# EAGLE design Shield (EAGLE 7.2.0)
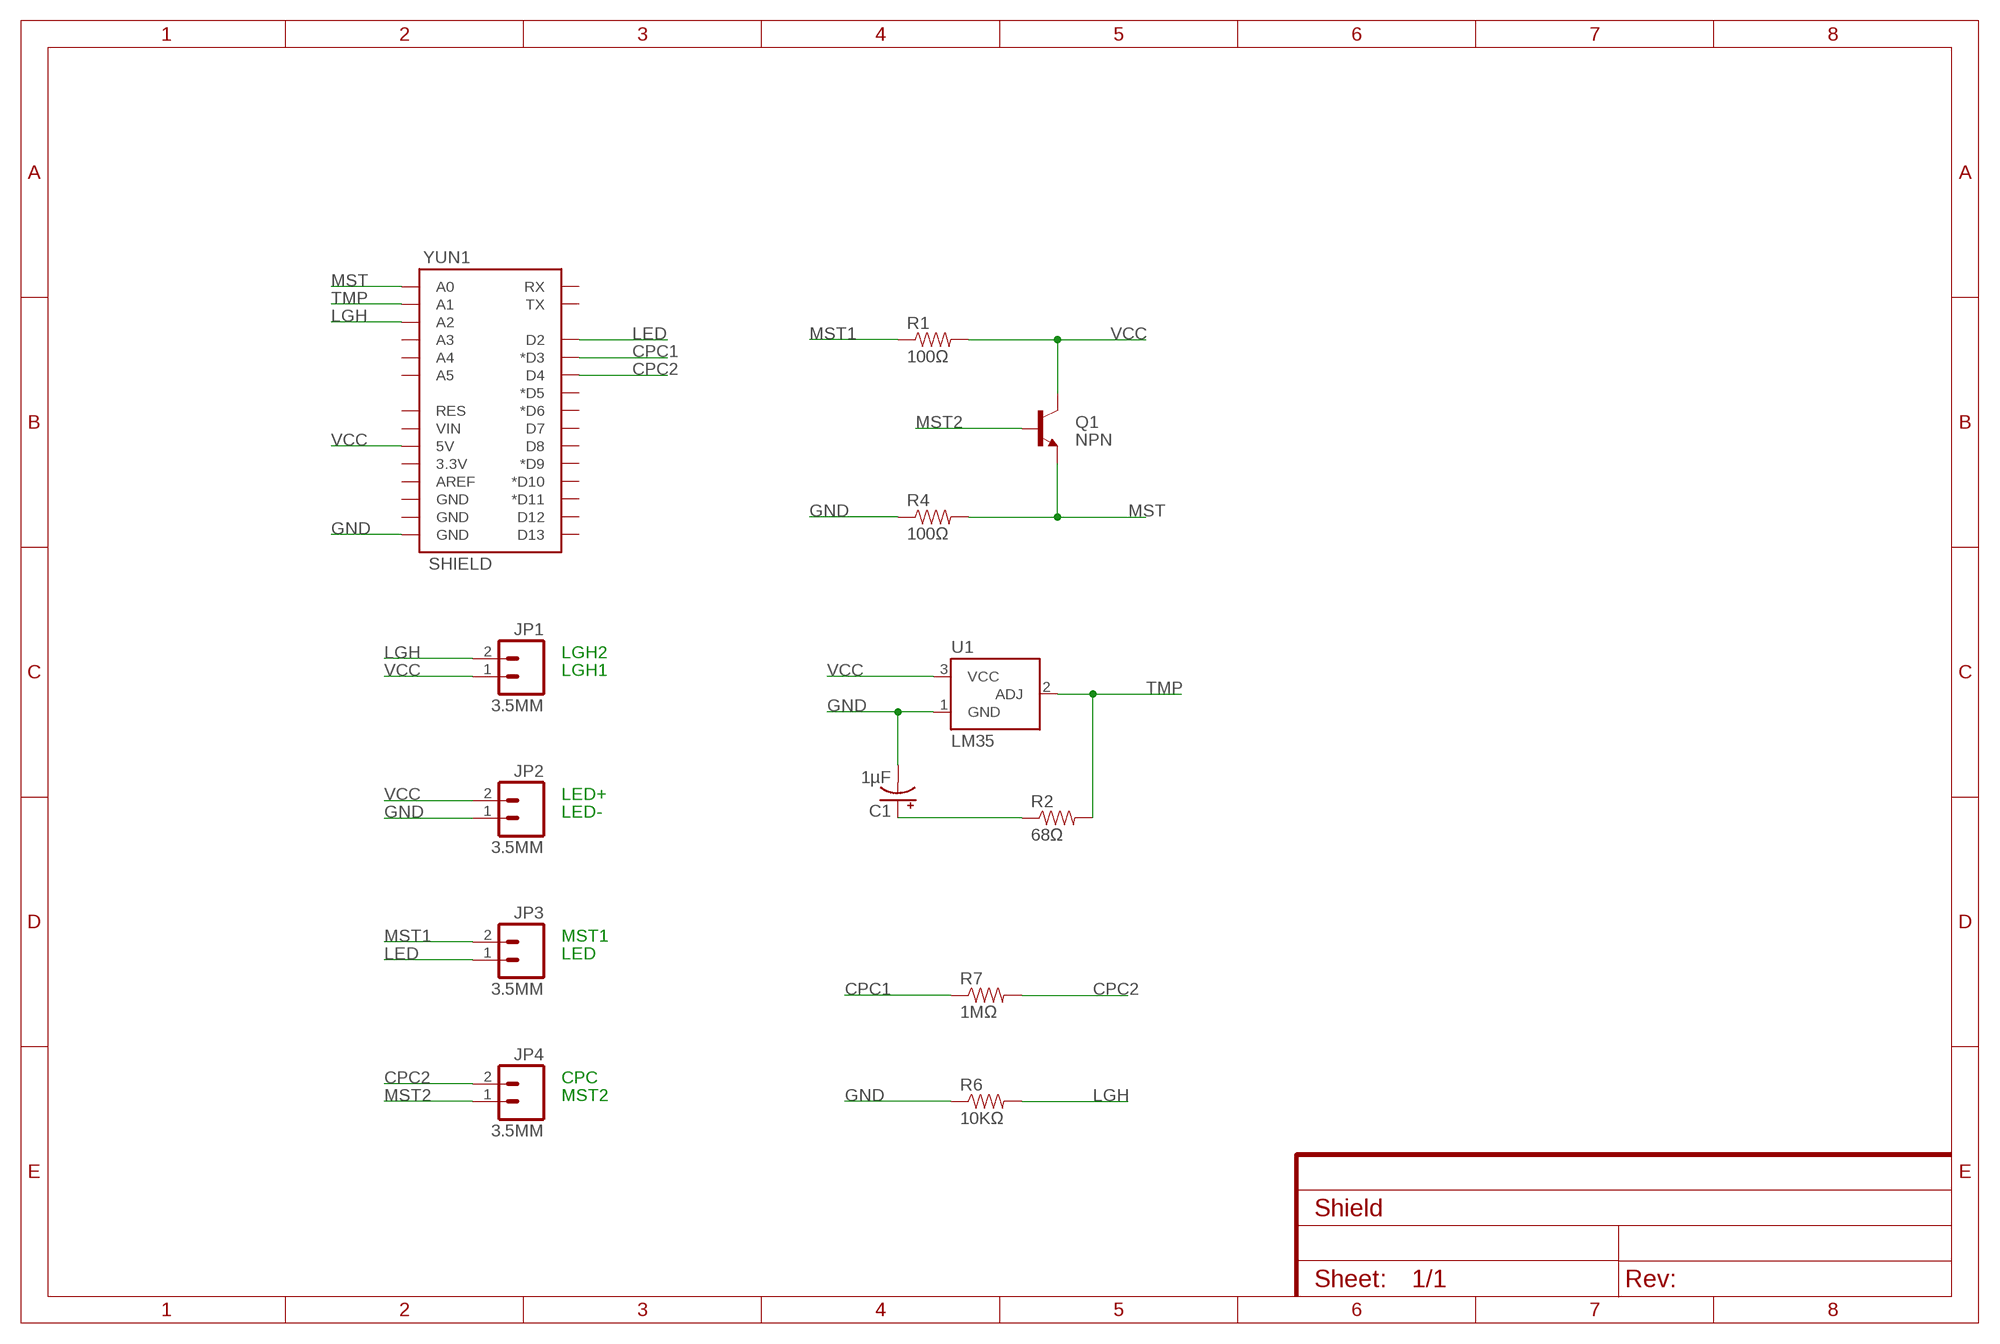
[diagram p0: schematic, sheet 1]
FRAME1 (FRAME-A4L): CNAME: EDEN; CREVISION: 1.0; DESIGNER: Joël Gähwiler

## Parts
C1  1µF  CAP_POLPTH1  [CPOL-RADIAL-100UF-25V]
JP1  3.5MM  M023.5MM  [SCREWTERMINAL-3.5MM-2]
JP2  3.5MM  M023.5MM  [SCREWTERMINAL-3.5MM-2]
JP3  3.5MM  M023.5MM  [SCREWTERMINAL-3.5MM-2]
JP4  3.5MM  M023.5MM  [SCREWTERMINAL-3.5MM-2]
Q1  NPN  TRANSISTOR_NPNBC547  [TO-92-AMMO]
R1  100Ω  RESISTORAXIAL-0.3  [AXIAL-0.3]
R2  68Ω  RESISTORAXIAL-0.3  [AXIAL-0.3]
R4  100Ω  RESISTORAXIAL-0.3  [AXIAL-0.3]
R6  10KΩ  RESISTORAXIAL-0.3  [AXIAL-0.3]
R7  1MΩ  RESISTORAXIAL-0.3  [AXIAL-0.3]
U1  LM35  TEMPERATURE-SENSOR  [TO-92]
YUN1  SHIELD  ARDUINO_SHIELDNO_SILK  [DUEMILANOVE_VIAS]

## Nets
CPC1: R7.P$1 YUN1.D3(*D3)
CPC2: JP4.2 R7.P$2 YUN1.D4
GND: C1.2(-) JP2.1 R4.P$1 R6.P$1 U1.1(GND) YUN1.GND@0(GND)
LED: JP3.1 YUN1.D2
LGH: JP1.2 R6.P$2 YUN1.A2
MST: Q1.3(E) R4.P$2 YUN1.A0
MST1: JP3.2 R1.P$1
MST2: JP4.1 Q1.2(B)
N$1: C1.1(+) R2.P$1
TMP: R2.P$2 U1.2(ADJ) YUN1.A1
VCC: JP1.1 JP2.2 Q1.1(C) R1.P$2 U1.3(VCC) YUN1.5V
Unconnected: YUN1.3.3V YUN1.A3 YUN1.A4 YUN1.A5 YUN1.AREF YUN1.D5(*D5) YUN1.D6(*D6) YUN1.D7 YUN1.D8 YUN1.D9(*D9) YUN1.D10(*D10) YUN1.D11(*D11) YUN1.D12 YUN1.D13 YUN1.GND@1(GND) YUN1.GND@2(GND) YUN1.RES YUN1.RX YUN1.TX YUN1.VIN

## Notes on the sheet
- LGH2
- LGH1
- LED+
- LED-
- MST1
- LED
- CPC
- MST2

## Library data of the parts
C1 = SparkFun-Capacitors:CAP_POL: Capacitor Polarized These are standard SMD and PTH capacitors. Normally 10uF, 47uF, and 100uF in electrolytic and tantalum varieties. Always verify the external diameter of the through hole cap, it varies with capacity, voltage, and manufacturer. The EIA devices should be standard.
JP1-JP4 = SparkFun-Connectors:M02: Standard 2-pin 0.1" header. Use with - straight break away headers ( PRT-00116) - right angle break away headers (PRT-00553) - swiss pins (PRT-00743) - machine pins (PRT-00117) - female headers (PRT-00115) Molex polarized connector foot print use with: PRT-08233 with associated crimp pins and housings. 2.54_SCREWTERM for use with PRT-10571. 3.5mm Screw Terminal footprints for PRT-08084 5mm Screw Terminal footprints for use with PRT-08432; PROD_ID: CONN-08399
Q1 = SparkFun-DiscreteSemi:TRANSISTOR_NPN: Generic NPN BJT MMBT2222A - TRANS-08049 (SOT-23, 1A 40V) MPSA42 - TRANS-09116 (SOT-23, 500mA 300V) MMBT5088LT1G - TRANS-11160 (SOT-23, 50 mA 30V) BC547 - COM-08928 <http://www.sparkfun.com/products/8928> (TO-92 45V 100mA) (1.Collector 2.Base 3.Emitter) 2N3904 - COM-00521 <http://www.sparkfun.com/products/521> (TO-92 40V 200mA) (1.Emitter 2.Base 3.Collector) P2N2222A - COM-12852 <http://www.sparkfun.com/products/12852> (TO-92 40V 600mA) (1.Collector 2.Base 3.Emitter)
R1 R2 R4 R6 R7 = SparkFun-Passives:RESISTOR: Resistor Basic schematic elements and footprints for 0603, 1206, and PTH resistors.
U1 = SparkFun-Sensors:TEMPERATURE-SENSOR: TO-92 temp sensor
YUN1 = SparkFun-Boards:ARDUINO_SHIELD: Arduino shield footprint

## Board
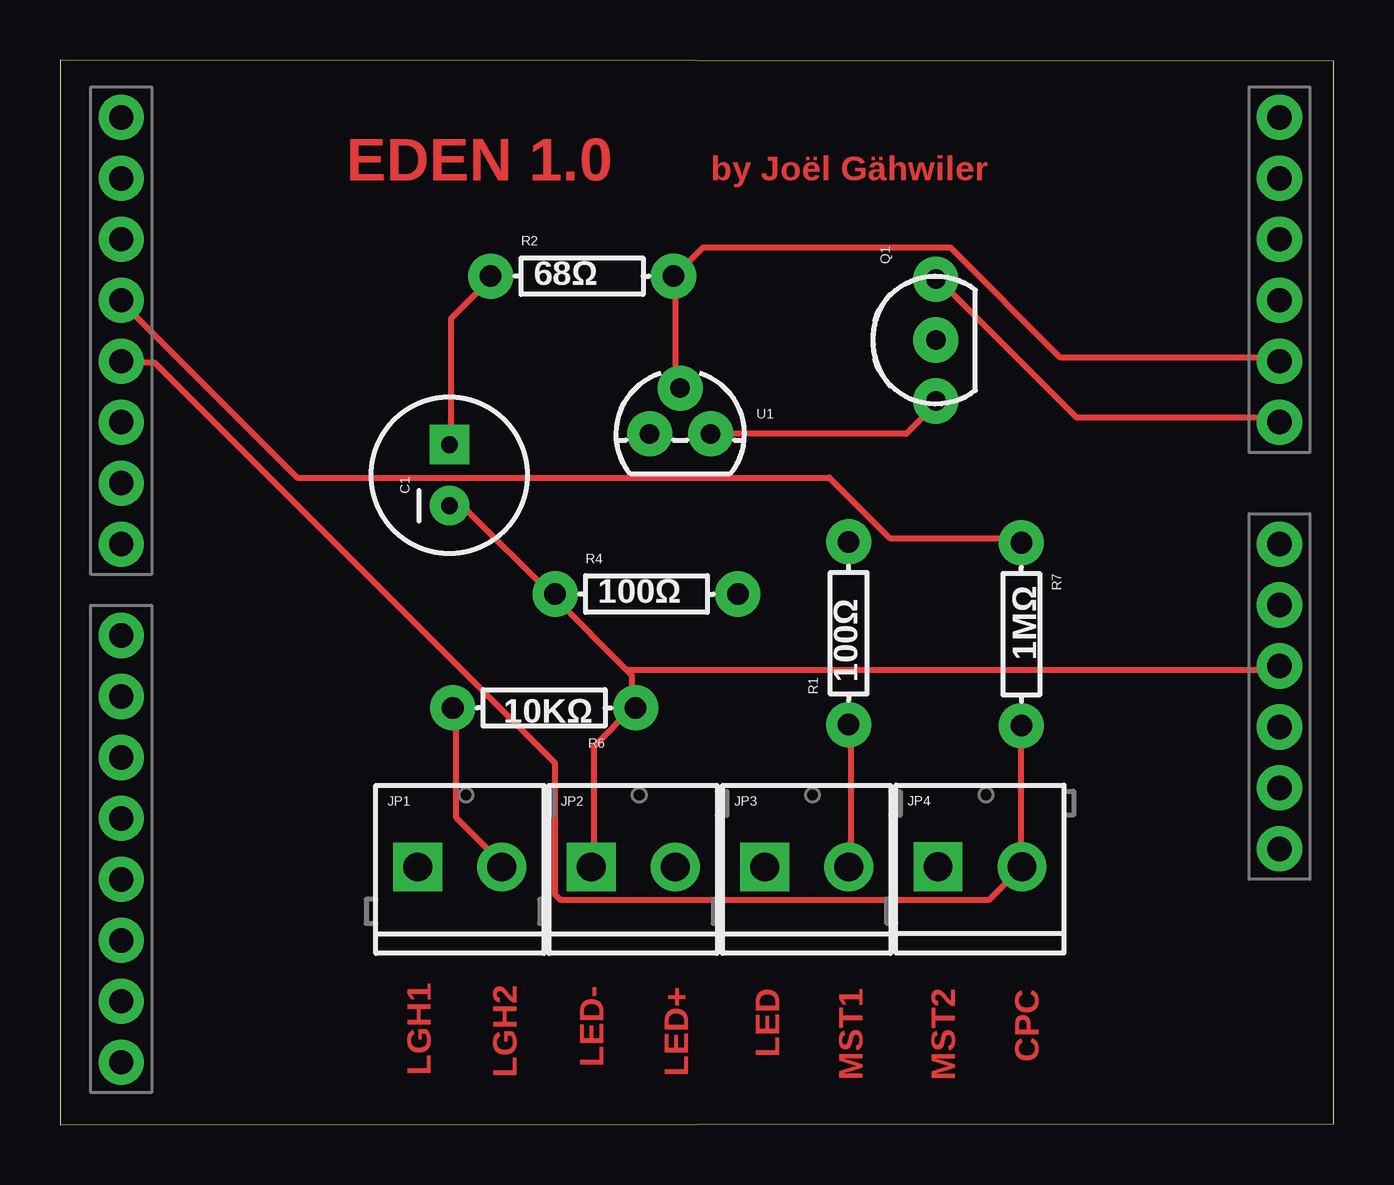
[diagram p1: board, top side]
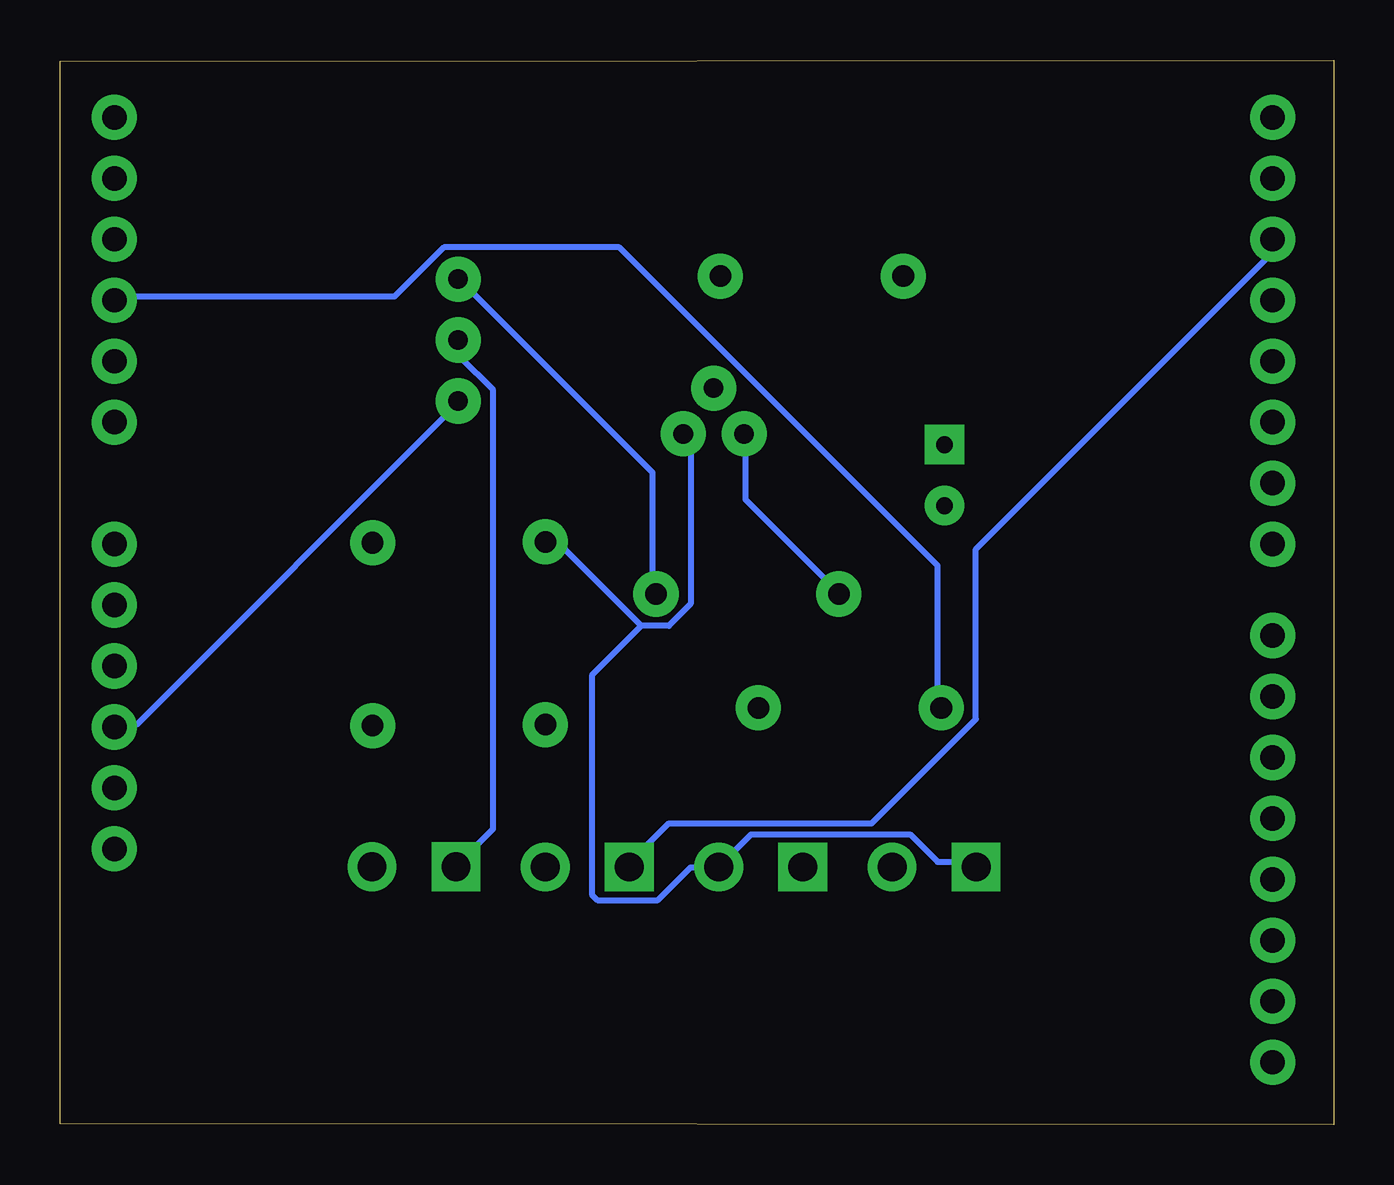
[diagram p2: board, bottom side, seen from below]

Size 53.08 x 44.36 mm. Coordinates in mm from the lower left corner, seen from the top.
Outline: 0,0 53.07,0.04 53.08,44.32 0.02,44.36 0,0
Copper layers (1*16): Top 0.035mm / dielectric 1.5mm / Bottom 0.035mm
Design rules "default": minimum track width 10mil, minimum drill 24mil, track to track 8mil, track to pad 8mil, pad to pad 8mil, via to via 8mil, smd to smd 8mil, copper to edge 40mil, drill to drill 8mil, minimum pad ring 10mil, minimum via ring 8mil, stop-mask expansion 4mil, vias tented up to drill 0mil, thermal gap 10mil

### Footprints (pad centres in the part's own frame; a part is rotated, then mirrored left to right if it is on the bottom)
CPOL-RADIAL-100UF-25V = drill 0.7 pad 1.651 square: 1 1.27,0 | drill 0.7 pad 1.651: 2 -1.27,0
SCREWTERMINAL-3.5MM-2 = drill 1.2 pad 2.032 square: 1 0,0 | drill 1.2 pad 2.032: 2 3.5,0
TO-92-AMMO = drill 0.813 pad 1.88: 1 -2.54,0; 2 0,0; 3 2.54,0
AXIAL-0.3 = drill 0.9 pad 1.88: P$1 -3.81,0; P$2 3.81,0
TO-92 = drill 0.813 pad 1.88: 1 -1.27,0; 2 0,1.905; 3 1.27,0
DUEMILANOVE_VIAS = drill 1.016 pad 1.88: 3.3V 50.8,13.97; 5V 50.8,16.51; A0 50.8,29.21; A1 50.8,31.75; A2 50.8,34.29; A3 50.8,36.83; A4 50.8,39.37; A5 50.8,41.91; AREF 2.54,2.54; D2 2.54,36.83; D3 2.54,34.29; D4 2.54,31.75; D5 2.54,29.21; D6 2.54,26.67; D7 2.54,24.13; D8 2.54,20.32; D9 2.54,17.78; D10 2.54,15.24; D11 2.54,12.7; D12 2.54,10.16; D13 2.54,7.62; GND@0 50.8,19.05; GND@1 50.8,21.59; GND@2 2.54,5.08; RES 50.8,11.43; RX 2.54,41.91; TX 2.54,39.37; VIN 50.8,24.13

### Placement (x,y rotation side)
C1  16.23,27.06 90 top
JP1  14.91,10.74 0 top
JP2  22.13,10.74 0 top
JP3  29.36,10.74 0 top
JP4  36.58,10.75 0 top
Q1  36.49,32.69 90 top
R1  32.86,20.48 90 top
R2  21.75,35.36 0 top
R4  24.44,22.11 0 top
R6  20.17,17.37 180 top
R7  40.05,20.44 270 top
U1  25.84,28.78 0 top
YUN1  0.01,0.06 0 top

### Tracks (layer width: path | path; a pad name or v marks a point on that pad's centre or on a via)
CPC1
  Top 0.254: R7.P$1 39.83,24.44 34.57,24.44 32.06,26.96 9.88,26.96 2.57,34.27 YUN1.D3
CPC2
  Top 0.254: R7.P$2 40.06,16.44 40.06,10.96 JP4.2 40.06,10.73 38.69,9.36 20.86,9.36 20.63,9.58 20.63,15.07 3.94,31.76 2.57,31.76 YUN1.D4
GND
  Top 0.254: C1.2 16.29,25.59 16.97,25.59 20.4,22.16 R4.P$1 20.63,21.93 23.6,18.96 | 23.6,18.96 23.83,18.73 23.83,17.58 R6.P$1 23.83,17.36 22.23,15.76 22.23,10.96 JP2.1 | 23.6,18.96 50.8,18.96 YUN1.GND@0
  Bottom 0.254: U1.1 24.52,28.56 24.52,26.04 20.63,22.16 R4.P$1
LED
  Bottom 0.254: YUN1.D2 2.57,36.79 2.57,36.33 14.91,23.99 14.91,16.9 19.26,12.56 27.72,12.56 29.32,10.96 JP3.1
LGH
  Top 0.254: R6.P$2 16.51,17.36 16.51,12.78 18.34,10.96 JP1.2
  Bottom 0.254: YUN1.A2 50.8,34.5 39.15,34.5 37.09,36.56 29.77,36.56 16.51,23.3 16.51,17.58 R6.P$2
MST
  Top 0.254: YUN1.A0 50.8,29.47 42.35,29.47 36.63,35.19 Q1.3
  Bottom 0.254: R4.P$2 28.4,22.16 28.4,27.19 36.4,35.19 Q1.3
MST1
  Top 0.254: R1.P$1 32.97,16.44 32.97,10.96 JP3.2
MST2
  Bottom 0.254: Q1.2 36.4,32.67 36.4,31.99 35.03,30.62 35.03,12.33 36.4,10.96 JP4.1
N$1
  Top 0.254: C1.1 16.29,28.56 16.29,33.59 17.89,35.19 R2.P$1
TMP
  Top 0.254: U1.2 25.66,30.84 25.66,35.19 R2.P$2 25.66,35.42 26.8,36.56 37.09,36.56 41.66,31.99 50.8,31.99 YUN1.A1
VCC
  Top 0.254: U1.3 27.26,28.79 35.26,28.79 36.4,29.93 Q1.1
  Bottom 0.254: JP1.1 14.91,10.96 16.51,10.96 17.66,12.1 24.29,12.1 25.43,10.96 JP2.2 25.66,10.73 26.8,10.73 28.17,9.36 30.69,9.36 30.92,9.58 30.92,18.73 28.86,20.79 | 28.86,20.79 32.29,24.21 32.74,24.21 R1.P$2 | 28.86,20.79 27.72,20.79 26.8,21.7 26.8,28.33 27.03,28.56 U1.3 | YUN1.5V 50.8,16.67 49.89,16.67 36.63,29.93 Q1.1

### Text on the board
Top: EDEN 1.0 | by Joël Gähwiler | LGH1 | LGH2 | LED- | LED+ | LED | MST1 | MST2 | CPC